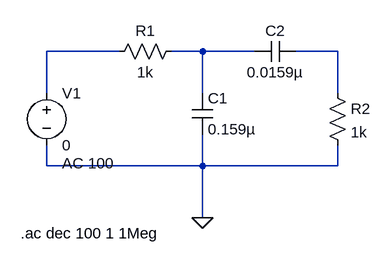
[diagram p0: schematic Band pass filter.asc]
Band pass filter.asc, the LTspice schematic file:
Version 4.1
SHEET 1 880 680
WIRE 160 64 48 64
WIRE 288 64 240 64
WIRE 368 64 288 64
WIRE 496 64 432 64
WIRE 48 128 48 64
WIRE 288 128 288 64
WIRE 496 128 496 64
WIRE 48 240 48 208
WIRE 288 240 288 192
WIRE 288 240 48 240
WIRE 496 240 496 208
WIRE 496 240 288 240
WIRE 288 320 288 240
FLAG 288 320 0
SYMBOL voltage 48 112 R0
WINDOW 123 24 124 Left 2
WINDOW 39 0 0 Left 0
SYMATTR InstName V1
SYMATTR Value 0
SYMATTR Value2 AC 100
SYMBOL res 256 48 R90
WINDOW 0 0 56 VBottom 2
WINDOW 3 32 56 VTop 2
SYMATTR InstName R1
SYMATTR Value 1k
SYMBOL cap 272 128 R0
SYMATTR InstName C1
SYMATTR Value 0.159µ
SYMBOL cap 432 48 R90
WINDOW 0 0 32 VBottom 2
WINDOW 3 32 32 VTop 2
SYMATTR InstName C2
SYMATTR Value 0.0159µ
SYMBOL res 480 112 R0
SYMATTR InstName R2
SYMATTR Value 1k
TEXT 8 344 Left 2 !.ac dec 100 1 1Meg

The netlist it stands for:
* Band pass filter.asc
V1 N001 0 0 AC 100
R1 N002 N001 1k
C1 N002 0 0.159µ
C2 N003 N002 0.0159µ
R2 N003 0 1k
.ac dec 100 1 1Meg
.backanno
.end